# Altium schematic sheet Tubes.SchDoc
size A4; SheetNumber: 2; SheetTotal: 4
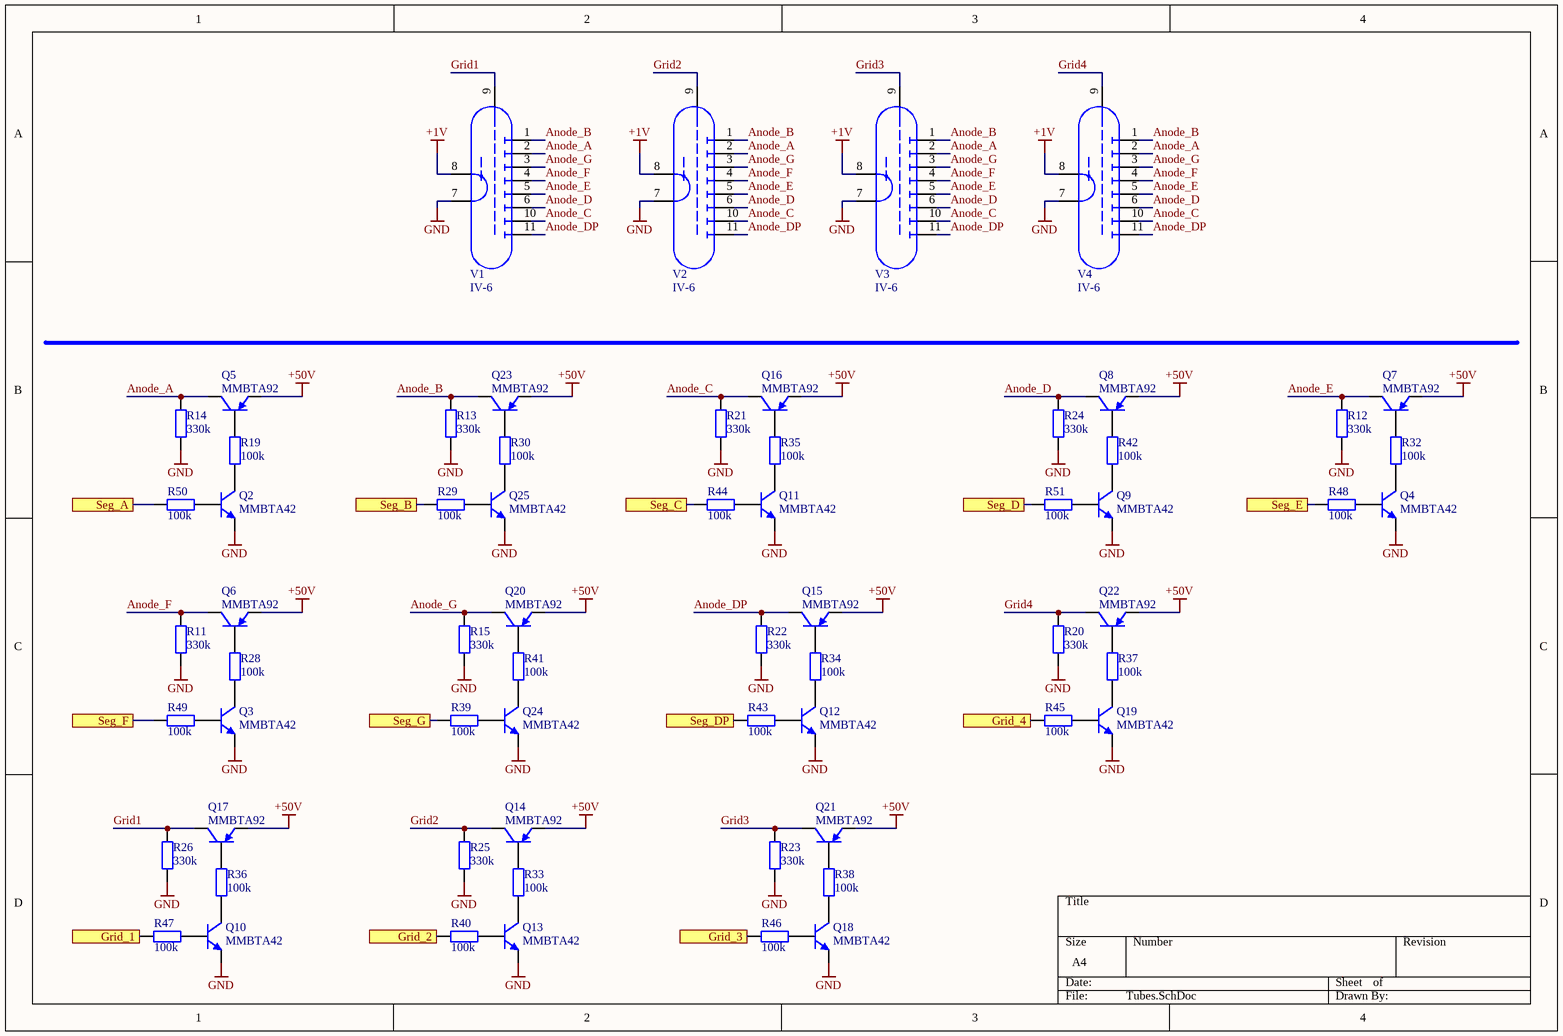
[diagram p0: Tubes.SchDoc]

## Parts
Q2  MMBTA42  [SOT-23_N]
Q3  MMBTA42  [SOT-23_N]
Q4  MMBTA42  [SOT-23_N]
Q5  MMBTA92  [SOT-23B_N]
Q6  MMBTA92  [SOT-23B_N]
Q7  MMBTA92  [SOT-23B_N]
Q8  MMBTA92  [SOT-23B_N]
Q9  MMBTA42  [SOT-23_N]
Q10  MMBTA42  [SOT-23_N]
Q11  MMBTA42  [SOT-23_N]
Q12  MMBTA42  [SOT-23_N]
Q13  MMBTA42  [SOT-23_N]
Q14  MMBTA92  [SOT-23B_N]
Q15  MMBTA92  [SOT-23B_N]
Q16  MMBTA92  [SOT-23B_N]
Q17  MMBTA92  [SOT-23B_N]
Q18  MMBTA42  [SOT-23_N]
Q19  MMBTA42  [SOT-23_N]
Q20  MMBTA92  [SOT-23B_N]
Q21  MMBTA92  [SOT-23B_N]
Q22  MMBTA92  [SOT-23B_N]
Q23  MMBTA92  [SOT-23B_N]
Q24  MMBTA42  [SOT-23_N]
Q25  MMBTA42  [SOT-23_N]
R11  330k  [RES 0805_2012]
R12  330k  [RES 0805_2012]
R13  330k  [RES 0805_2012]
R14  330k  [RES 0805_2012]
R15  330k  [RES 0805_2012]
R19  100k  [J1-0603]
R20  330k  [RES 0805_2012]
R21  330k  [RES 0805_2012]
R22  330k  [RES 0805_2012]
R23  330k  [RES 0805_2012]
R24  330k  [RES 0805_2012]
R25  330k  [RES 0805_2012]
R26  330k  [RES 0805_2012]
R28  100k  [J1-0603]
R29  100k  [J1-0603]
R30  100k  [J1-0603]
R32  100k  [J1-0603]
R33  100k  [J1-0603]
R34  100k  [J1-0603]
R35  100k  [J1-0603]
R36  100k  [J1-0603]
R37  100k  [J1-0603]
R38  100k  [J1-0603]
R39  100k  [J1-0603]
R40  100k  [J1-0603]
R41  100k  [J1-0603]
R42  100k  [J1-0603]
R43  100k  [J1-0603]
R44  100k  [J1-0603]
R45  100k  [J1-0603]
R46  100k  [J1-0603]
R47  100k  [J1-0603]
R48  100k  [J1-0603]
R49  100k  [J1-0603]
R50  100k  [J1-0603]
R51  100k  [J1-0603]
V1  IV-6  [IV-6]
V2  IV-6  [IV-6]
V3  IV-6  [IV-6]
V4  IV-6  [IV-6]

## Ports
Grid_1 (see main[2C]), Grid_2 (see main[2C]), Grid_3 (see main[2C]), Grid_4 (see main[2C]), Seg_A (see main[2B]), Seg_B (see main[2B]), Seg_C (see main[2B]), Seg_D (see main[2C]), Seg_DP (see main[2C]), Seg_E (see main[2C]), Seg_F (see main[2C]), Seg_G (see main[2C])

## Nets
+1V: V1.8 V2.8 V3.8 V4.8
+50V: Q5.3(E) Q6.3(E) Q7.3(E) Q8.3(E) Q14.3(E) Q15.3(E) Q16.3(E) Q17.3(E) Q20.3(E) Q21.3(E) Q22.3(E) Q23.3(E)
GND: Q2.3(E) Q3.3(E) Q4.3(E) Q9.3(E) Q10.3(E) Q11.3(E) Q12.3(E) Q13.3(E) Q18.3(E) Q19.3(E) Q24.3(E) Q25.3(E) R11.1 R12.1 R13.1 R14.1 R15.1 R20.1 R21.1 R22.1 R23.1 R24.1 R25.1 R26.1 V1.7 V2.7 V3.7 V4.7
Anode_A: Q5.1(C) R14.2 V1.2 V2.2 V3.2 V4.2
Anode_B: Q23.1(C) R13.2 V1.1 V2.1 V3.1 V4.1
Anode_C: Q16.1(C) R21.2 V1.10 V2.10 V3.10 V4.10
Anode_D: Q8.1(C) R24.2 V1.6 V2.6 V3.6 V4.6
Anode_DP: Q15.1(C) R22.2 V1.11 V2.11 V3.11 V4.11
Anode_E: Q7.1(C) R12.2 V1.5 V2.5 V3.5 V4.5
Anode_F: Q6.1(C) R11.2 V1.4 V2.4 V3.4 V4.4
Anode_G: Q20.1(C) R15.2 V1.3 V2.3 V3.3 V4.3
Grid1: Q17.1(C) R26.2 V1.9
Grid2: Q14.1(C) R25.2 V2.9
Grid3: Q21.1(C) R23.2 V3.9
Grid4: Q22.1(C) R20.2 V4.9
Grid_1: R47.1 ; port Grid_1
Grid_2: R40.1 ; port Grid_2
Grid_3: R46.1 ; port Grid_3
Grid_4: R45.1 ; port Grid_4
Seg_A: R50.1 ; port Seg_A
Seg_B: R29.1 ; port Seg_B
Seg_C: R44.1 ; port Seg_C
Seg_D: R51.1 ; port Seg_D
Seg_DP: R43.1 ; port Seg_DP
Seg_E: R48.1 ; port Seg_E
Seg_F: R49.1 ; port Seg_F
Seg_G: R39.1 ; port Seg_G
NetQ2_1: Q2.1(C) R19.1
NetQ2_2: Q2.2(B) R50.2
NetQ3_1: Q3.1(C) R28.1
NetQ3_2: Q3.2(B) R49.2
NetQ4_1: Q4.1(C) R32.1
NetQ4_2: Q4.2(B) R48.2
NetQ5_2: Q5.2(B) R19.2
NetQ6_2: Q6.2(B) R28.2
NetQ7_2: Q7.2(B) R32.2
NetQ8_2: Q8.2(B) R42.2
NetQ9_1: Q9.1(C) R42.1
NetQ9_2: Q9.2(B) R51.2
NetQ10_1: Q10.1(C) R36.1
NetQ10_2: Q10.2(B) R47.2
NetQ11_1: Q11.1(C) R35.1
NetQ11_2: Q11.2(B) R44.2
NetQ12_1: Q12.1(C) R34.1
NetQ12_2: Q12.2(B) R43.2
NetQ13_1: Q13.1(C) R33.1
NetQ13_2: Q13.2(B) R40.2
NetQ14_2: Q14.2(B) R33.2
NetQ15_2: Q15.2(B) R34.2
NetQ16_2: Q16.2(B) R35.2
NetQ17_2: Q17.2(B) R36.2
NetQ18_1: Q18.1(C) R38.1
NetQ18_2: Q18.2(B) R46.2
NetQ19_1: Q19.1(C) R37.1
NetQ19_2: Q19.2(B) R45.2
NetQ20_2: Q20.2(B) R41.2
NetQ21_2: Q21.2(B) R38.2
NetQ22_2: Q22.2(B) R37.2
NetQ23_2: Q23.2(B) R30.2
NetQ24_1: Q24.1(C) R41.1
NetQ24_2: Q24.2(B) R39.2
NetQ25_1: Q25.1(C) R30.1
NetQ25_2: Q25.2(B) R29.2

## Library data of the parts
Q2-Q4 Q9-Q13 Q18 Q19 Q24 Q25 = NPN: NPN Bipolar Transistor; Published: 8-Jun-2000; LatestRevisionDate: 17-Jul-2002; LatestRevisionNote: Re-released for DXP Platform.; PackageReference: TO-226-AA; Publisher: Altium Limited; PackageDescription: TO, Flat Index; 3 In-Line, Axial Leads; Body Dia. 4.8mm; Leads 0.55 x 0.51 mm (max); Code_JEDEC: TO-226-AA
Q5-Q8 Q14-Q17 Q20-Q23 = PNP: PNP Bipolar Transistor; Published: 8-Jun-2000; LatestRevisionDate: 29-May-2009; LatestRevisionNote: IPC-7351 Footprint Added.; PackageVersion: Aug-1999; PackageReference: SOT-23B; Publisher: Altium Limited; PackageDescription: 3-Pin SOT-23 Package 0.95 mm Pitch, 2.4 mm Lead Span
R11-R15 R19-R26 R28-R30 R32-R51 = Res2: Resistor; Value: 1K; Published: 8-Jun-2000; LatestRevisionDate: 17-Jul-2002; LatestRevisionNote: Re-released for DXP Platform.; PackageReference: AXIAL-0.4; Publisher: Altium Limited; PackageDescription: Axial Device, Thru-Hole; 2 Leads; 0.4 in Pin Spacing